# Altium project SSL_ESC_2024.PrjPcb
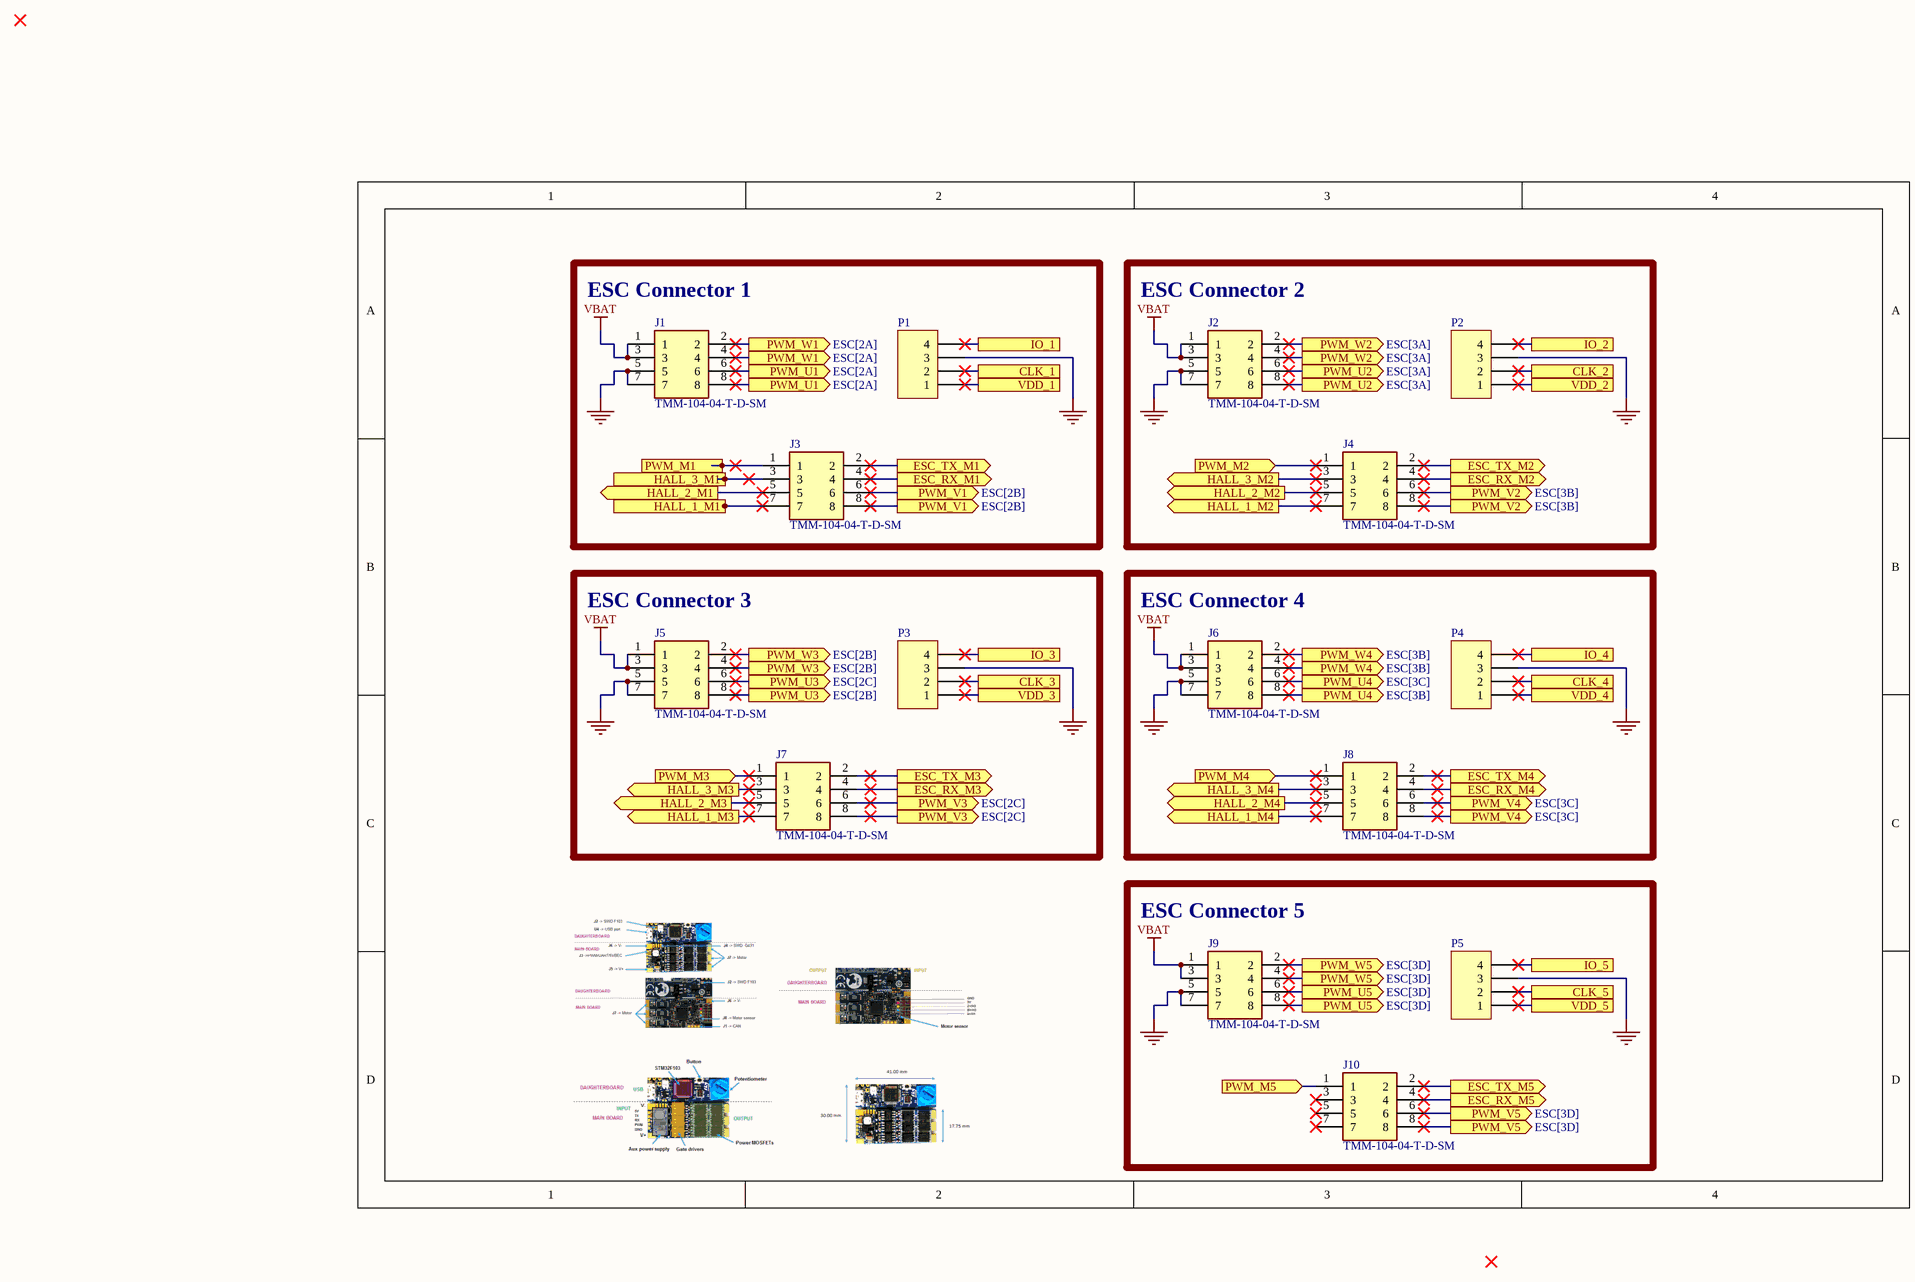
[diagram p0: ESC.SchDoc]
1 sheet, 15 parts. Net scope: flat (ports and power ports of the same name join across sheets).
Board file: ESC.PcbDoc

## Sheet ESC.SchDoc
size A4; SheetNumber: 1; SheetTotal: 1

### Parts
J1  TMM-104-04-T-D-SM  [TMM-104-YY-XX-D-SM]
J2  TMM-104-04-T-D-SM  [TMM-104-YY-XX-D-SM]
J3  TMM-104-04-T-D-SM  [TMM-104-YY-XX-D-SM]
J4  TMM-104-04-T-D-SM  [TMM-104-YY-XX-D-SM]
J5  TMM-104-04-T-D-SM  [TMM-104-YY-XX-D-SM]
J6  TMM-104-04-T-D-SM  [TMM-104-YY-XX-D-SM]
J7  TMM-104-04-T-D-SM  [TMM-104-YY-XX-D-SM]
J8  TMM-104-04-T-D-SM  [TMM-104-YY-XX-D-SM]
J9  TMM-104-04-T-D-SM  [TMM-104-YY-XX-D-SM]
J10  TMM-104-04-T-D-SM  [TMM-104-YY-XX-D-SM]
P1  Header 3  [My_1X04]  (value not drawn)
P2  Header 3  [My_1X04]  (value not drawn)
P3  Header 3  [My_1X04]  (value not drawn)
P4  Header 3  [My_1X04]  (value not drawn)
P5  Header 3  [My_1X04]  (value not drawn)

### Blocks framed on the sheet
ESC Connector 1: J1 J3 P1
ESC Connector 2: J2 J4 P2
ESC Connector 3: J5 J7 P3
ESC Connector 4: J6 J8 P4
ESC Connector 5: J9 J10 P5

### Ports
CLK_1, CLK_2, CLK_3, CLK_4, CLK_5, ESC_RX_M1 (out), ESC_RX_M2 (out), ESC_RX_M3 (out), ESC_RX_M4 (out), ESC_RX_M5 (out), ESC_TX_M1 (out), ESC_TX_M2 (out), ESC_TX_M3 (out), ESC_TX_M4 (out), ESC_TX_M5 (out), HALL_1_M1 (out), HALL_1_M2 (out), HALL_1_M3 (out), HALL_1_M4 (out), HALL_2_M1 (out), HALL_2_M2 (out), HALL_2_M3 (out), HALL_2_M4 (out), HALL_3_M1 (out), HALL_3_M2 (out), HALL_3_M3 (out), HALL_3_M4 (out), IO_1, IO_2, IO_3, IO_4, IO_5, PWM_M1 (in), PWM_M2 (in), PWM_M3 (in), PWM_M4 (in), PWM_M5 (in), PWM_U1 (out, see ESC[2A]), PWM_U2 (out, see ESC[3A]), PWM_U3 (out, see ESC[2B]), PWM_U3 (out, see ESC[2C]), PWM_U4 (out, see ESC[3B]), PWM_U4 (out, see ESC[3C]), PWM_U5 (out, see ESC[3D]), PWM_V1 (out, see ESC[2B]), PWM_V2 (out, see ESC[3B]), PWM_V3 (out, see ESC[2C]), PWM_V4 (out, see ESC[3C]), PWM_V5 (out, see ESC[3D]), PWM_W1 (out, see ESC[2A]), PWM_W2 (out, see ESC[3A]), PWM_W3 (out, see ESC[2B]), PWM_W4 (out, see ESC[3B]), PWM_W5 (out, see ESC[3D]), VDD_1, VDD_2, VDD_3, VDD_4, VDD_5

### Nets
GND: J1.5 J1.7 J2.5 J2.7 J5.5 J5.7 J6.5 J6.7 J9.5 J9.7 P1.3 P2.3 P3.3 P4.3 P5.3
VBAT: J1.1 J1.3 J2.1 J2.3 J5.1 J5.3 J6.1 J6.3 J9.1 J9.3
NetJ1_2: J1.2 J1.4 ; port PWM_W1
NetJ1_6: J1.6 J1.8 ; port PWM_U1
NetJ2_2: J2.2 J2.4 ; port PWM_W2
NetJ2_6: J2.6 J2.8 ; port PWM_U2
NetJ3_1: J3.1 ; port PWM_M1
NetJ3_2: J3.2 ; port ESC_TX_M1
NetJ3_3: J3.3 ; port HALL_3_M1
NetJ3_4: J3.4 ; port ESC_RX_M1
NetJ3_5: J3.5 ; port HALL_2_M1
NetJ3_6: J3.6 J3.8 ; port PWM_V1
NetJ3_7: J3.7 ; port HALL_1_M1
NetJ4_1: J4.1 ; port PWM_M2
NetJ4_2: J4.2 ; port ESC_TX_M2
NetJ4_3: J4.3 ; port HALL_3_M2
NetJ4_4: J4.4 ; port ESC_RX_M2
NetJ4_5: J4.5 ; port HALL_2_M2
NetJ4_6: J4.6 J4.8 ; port PWM_V2
NetJ4_7: J4.7 ; port HALL_1_M2
NetJ5_2: J5.2 J5.4 ; port PWM_W3
NetJ5_6: J5.6 J5.8 ; port PWM_U3
NetJ6_2: J6.2 J6.4 ; port PWM_W4
NetJ6_6: J6.6 J6.8 ; port PWM_U4
NetJ7_1: J7.1 ; port PWM_M3
NetJ7_2: J7.2 ; port ESC_TX_M3
NetJ7_3: J7.3 ; port HALL_3_M3
NetJ7_4: J7.4 ; port ESC_RX_M3
NetJ7_5: J7.5 ; port HALL_2_M3
NetJ7_6: J7.6 J7.8 ; port PWM_V3
NetJ7_7: J7.7 ; port HALL_1_M3
NetJ8_1: J8.1 ; port PWM_M4
NetJ8_2: J8.2 ; port ESC_TX_M4
NetJ8_3: J8.3 ; port HALL_3_M4
NetJ8_4: J8.4 ; port ESC_RX_M4
NetJ8_5: J8.5 ; port HALL_2_M4
NetJ8_6: J8.6 J8.8 ; port PWM_V4
NetJ8_7: J8.7 ; port HALL_1_M4
NetJ9_2: J9.2 J9.4 ; port PWM_W5
NetJ9_6: J9.6 J9.8 ; port PWM_U5
NetJ10_1: J10.1 ; port PWM_M5
NetJ10_2: J10.2 ; port ESC_TX_M5
NetJ10_4: J10.4 ; port ESC_RX_M5
NetJ10_6: J10.6 J10.8 ; port PWM_V5
NetP1_1: P1.1 ; port VDD_1
NetP1_2: P1.2 ; port CLK_1
NetP1_4: P1.4 ; port IO_1
NetP2_1: P2.1 ; port VDD_2
NetP2_2: P2.2 ; port CLK_2
NetP2_4: P2.4 ; port IO_2
NetP3_1: P3.1 ; port VDD_3
NetP3_2: P3.2 ; port CLK_3
NetP3_4: P3.4 ; port IO_3
NetP4_1: P4.1 ; port VDD_4
NetP4_2: P4.2 ; port CLK_4
NetP4_4: P4.4 ; port IO_4
NetP5_1: P5.1 ; port VDD_5
NetP5_2: P5.2 ; port CLK_5
NetP5_4: P5.4 ; port IO_5

Not connected (* = marked no-connect by the designer): J10 3* 5* 7*

### Library data of the parts
J1-J10 = TMM-104-04-T-D-SM: Connector; Manufacturer_Name: SAMTEC; Datasheet Link: http://suddendocs.samtec.com/prints/tmm-1xx-xx-xx-x-sm-xx-x-mkt.pdf; Manufacturer_Part_Number: TMM-104-04-T-D-SM
P1-P5 = Header 4_1: Header, 4-Pin; ASiD Part Number: Header 4-AS